# Altium schematic sheet Test_Points.SchDoc
size A
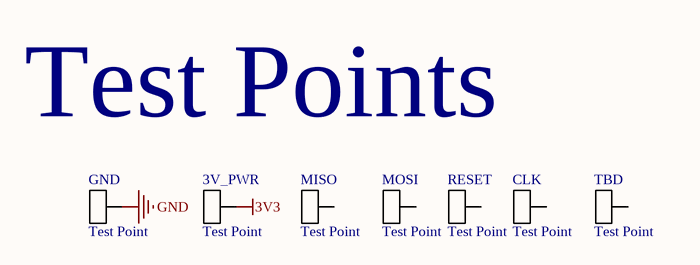
[diagram p0: Test_Points.SchDoc]

## Parts
3V_PWR  Test Point  [Test Point]
CLK  Test Point  [Test Point]
GND  Test Point  [Test Point]
MISO  Test Point  [Test Point]
MOSI  Test Point  [Test Point]
RESET  Test Point  [Test Point]
TBD  Test Point  [Test Point]

## Nets
3V3: 3V_PWR.1
GND: GND.1

Not connected (* = marked no-connect by the designer): CLK 1; MISO 1; MOSI 1; RESET 1; TBD 1

## Notes on the sheet
- Test Points

## Library data of the parts
3V_PWR CLK GND MISO MOSI RESET TBD = Test Point: Supplier 1: Digi-Key; Supplier Part Number 1: 5019KCT-ND